# EAGLE design untitled5 (EAGLE 7.6.0)
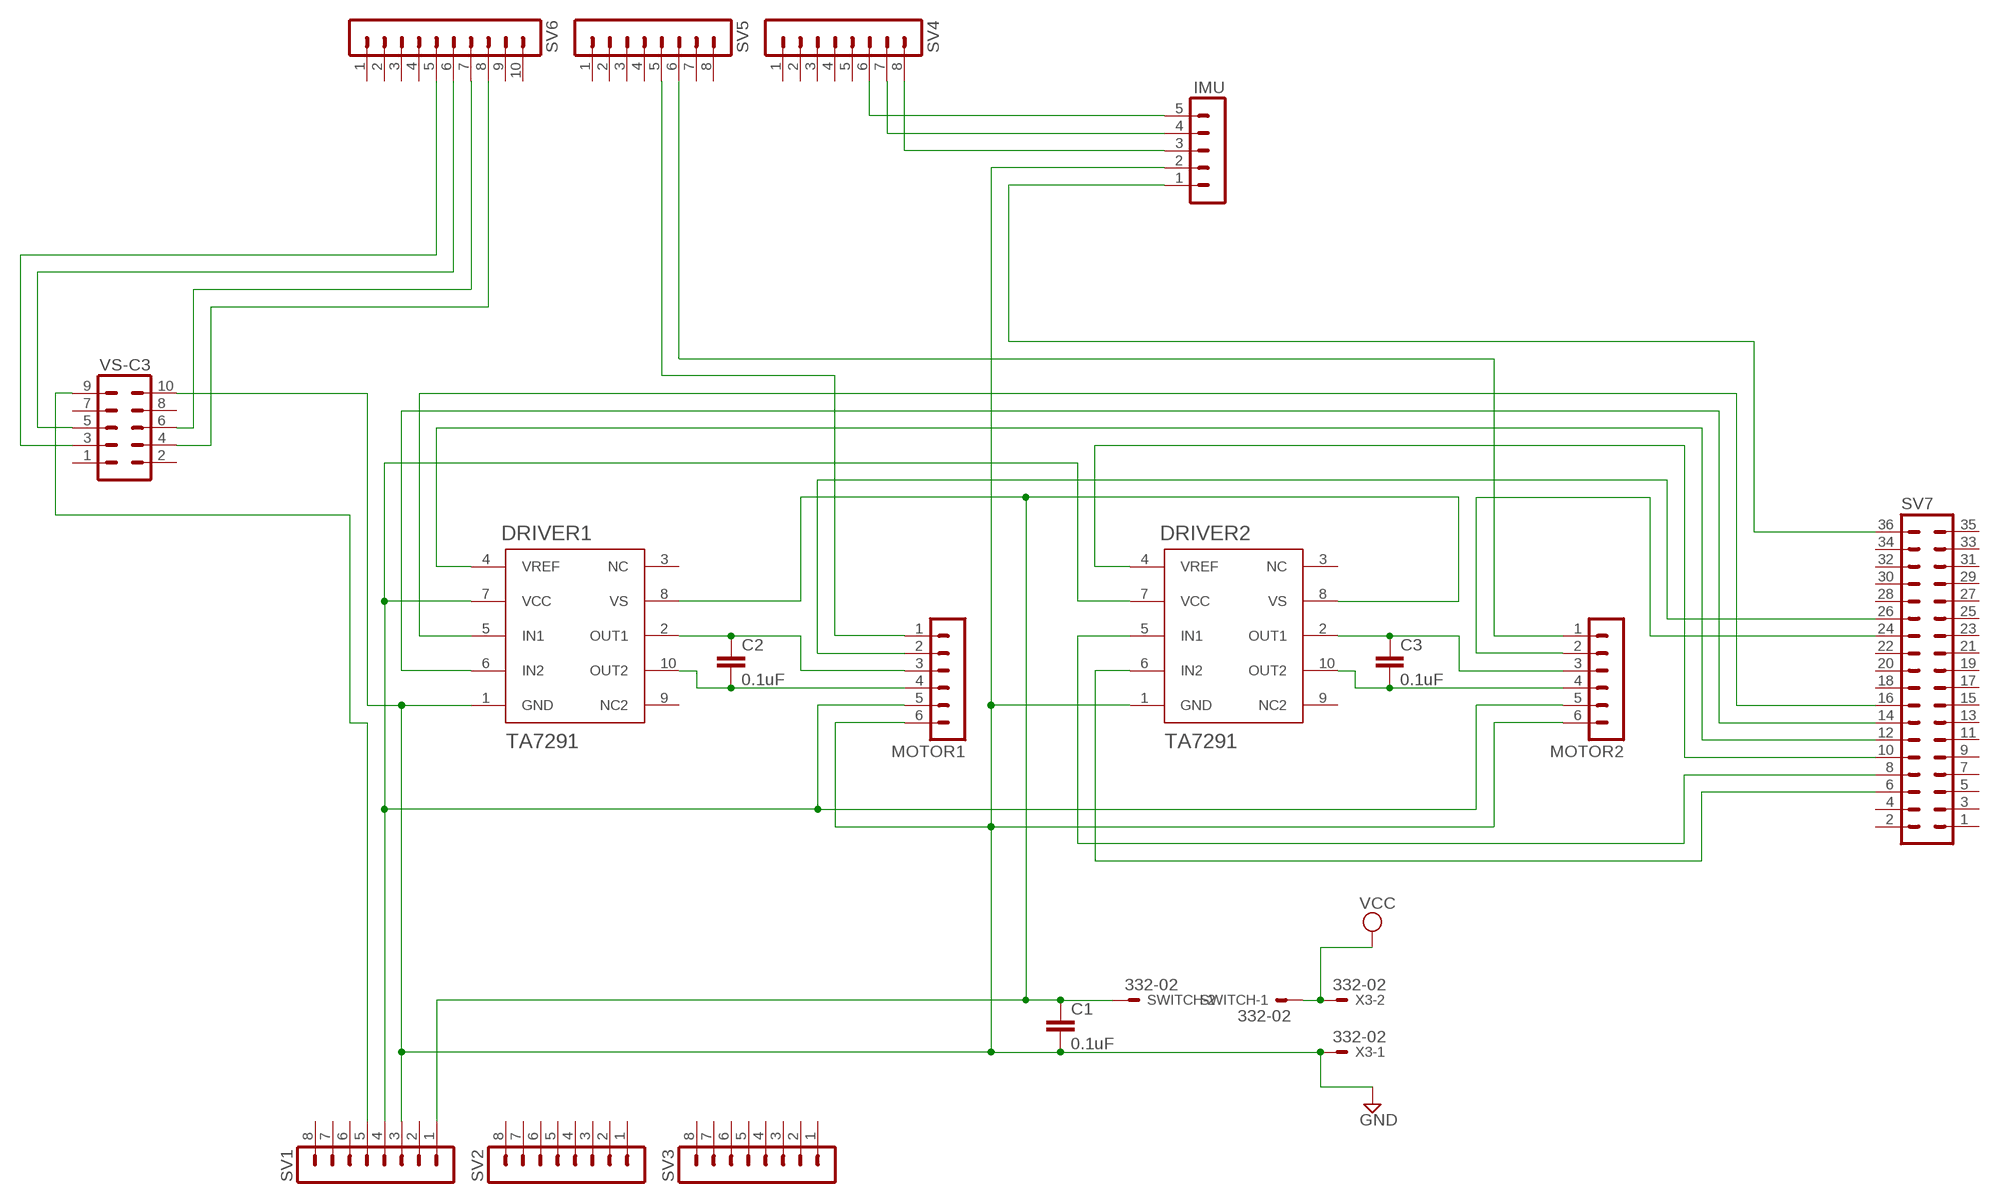
[diagram p0: schematic, sheet 1]

## Parts
C1  0.1uF  C5/2.5  [C5B2.5]
C2  0.1uF  C5/2.5  [C5B2.5]
C3  0.1uF  C5/2.5  [C5B2.5]
DRIVER1  TA7291  [HSIP10]
DRIVER2  TA7291  [HSIP10]
IMU  MA05-1  [MA05-1]
MOTOR1  MA06-1  [MA06-1]
MOTOR2  MA06-1  [MA06-1]
SV1  MA08-1  [MA08-1]
SV2  MA08-1  [MA08-1]
SV3  MA08-1  [MA08-1]
SV4  MA08-1  [MA08-1]
SV5  MA08-1  [MA08-1]
SV6  MA10-1  [MA10-1]
SV7  MA18-2  [MA18-2]
SWITCH  332-02  [332-02]
VS-C3  MA05-2  [MA05-2]
X3  332-02  [332-02]

## Nets
ENCODER: IMU.5 SV4.6
GND: C1.2 DRIVER1.1(GND) DRIVER2.1(GND) IMU.2 MOTOR1.6 MOTOR2.6 SV1.3 VS-C3.10 X3.1
N$1: C2.1 DRIVER1.2(OUT1) MOTOR1.3
N$2: C2.2 DRIVER1.10(OUT2) MOTOR1.4
N$3: C3.1 DRIVER2.2(OUT1) MOTOR2.3
N$4: C3.2 DRIVER2.10(OUT2) MOTOR2.4
N$5: IMU.1 SV7.36
N$6: MOTOR2.1 SV5.6
N$7: DRIVER1.7(VCC) DRIVER2.7(VCC) MOTOR1.5 MOTOR2.5 SV1.4
N$8: IMU.3 SV4.8
N$9: IMU.4 SV4.7
N$10: C1.1 DRIVER1.8(VS) DRIVER2.8(VS) SV1.1 SWITCH.2
N$11: DRIVER2.4(VREF) SV7.10
N$12: DRIVER1.5(IN1) SV7.16
N$13: MOTOR1.1 SV5.5
N$14: MOTOR1.2 SV7.26
N$15: MOTOR2.2 SV7.24
N$16: DRIVER1.6(IN2) SV7.14
N$17: DRIVER2.5(IN1) SV7.8
N$18: DRIVER2.6(IN2) SV7.6
N$19: SV1.5 VS-C3.9
N$20: SV6.6 VS-C3.5
N$21: SV6.5 VS-C3.3
N$22: SV6.8 VS-C3.4
N$23: SV6.7 VS-C3.6
N$24: DRIVER1.4(VREF) SV7.12
VCC: SWITCH.1 X3.2
Unconnected: DRIVER1.3(NC) DRIVER1.9(NC2) DRIVER2.3(NC) DRIVER2.9(NC2) SV1.2 SV1.6 SV1.7 SV1.8 SV2.1 SV2.2 SV2.3 SV2.4 SV2.5 SV2.6 SV2.7 SV2.8 SV3.1 SV3.2 SV3.3 SV3.4 SV3.5 SV3.6 SV3.7 SV3.8 SV4.1 SV4.2 SV4.3 SV4.4 SV4.5 SV5.1 SV5.2 SV5.3 SV5.4 SV5.7 SV5.8 SV6.1 SV6.2 SV6.3 SV6.4 SV6.9 SV6.10 SV7.1 SV7.2 SV7.3 SV7.4 SV7.5 SV7.7 SV7.9 SV7.11 SV7.13 SV7.15 SV7.17 SV7.18 SV7.19 SV7.20 SV7.21 SV7.22 SV7.23 SV7.25 SV7.27 SV7.28 SV7.29 SV7.30 SV7.31 SV7.32 SV7.33 SV7.34 SV7.35 VS-C3.1 VS-C3.2 VS-C3.7 VS-C3.8

## Library data of the parts
C1-C3 = capacitor-wima:C: CAPACITOR naming: grid - package width
DRIVER1 DRIVER2 = TA7291P:TA7291
IMU = con-lstb:MA05-1: PIN HEADER; OC_FARNELL: unknown; OC_NEWARK: unknown
MOTOR1 MOTOR2 = con-lstb:MA06-1: PIN HEADER; OC_FARNELL: unknown; OC_NEWARK: unknown
SV1-SV5 = con-lstb:MA08-1: PIN HEADER; OC_FARNELL: unknown; OC_NEWARK: unknown
SV6 = con-lstb:MA10-1: PIN HEADER; OC_FARNELL: unknown; OC_NEWARK: unknown
SV7 = con-lstb:MA18-2: PIN HEADER; OC_FARNELL: unknown; OC_NEWARK: unknown
SWITCH X3 = con-garry:332-02: 2 Pin - 2mm Dual Row Source: www.mpe-connector.de / garry_shortform_2012.pdf
VS-C3 = con-lstb:MA05-2: PIN HEADER; OC_FARNELL: unknown; OC_NEWARK: unknown

## Board
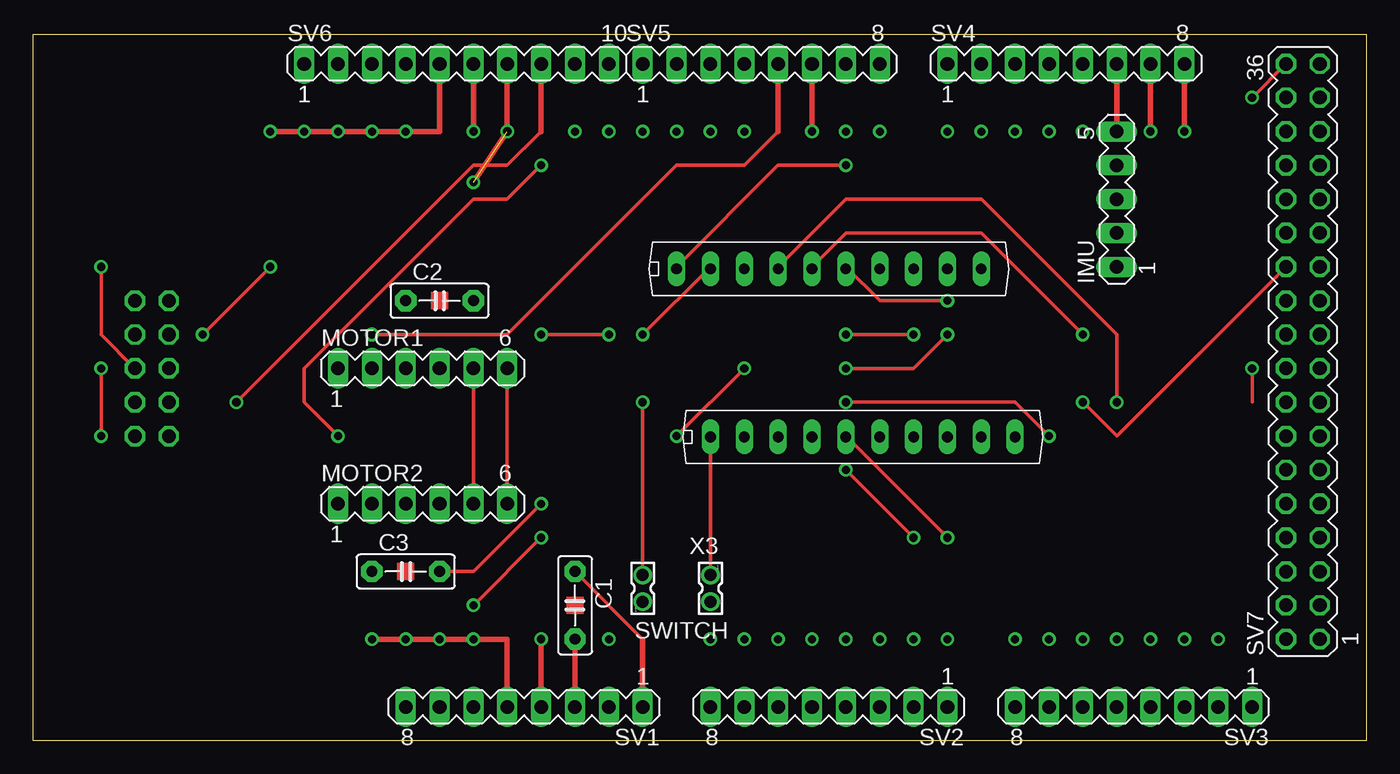
[diagram p1: board, top side]
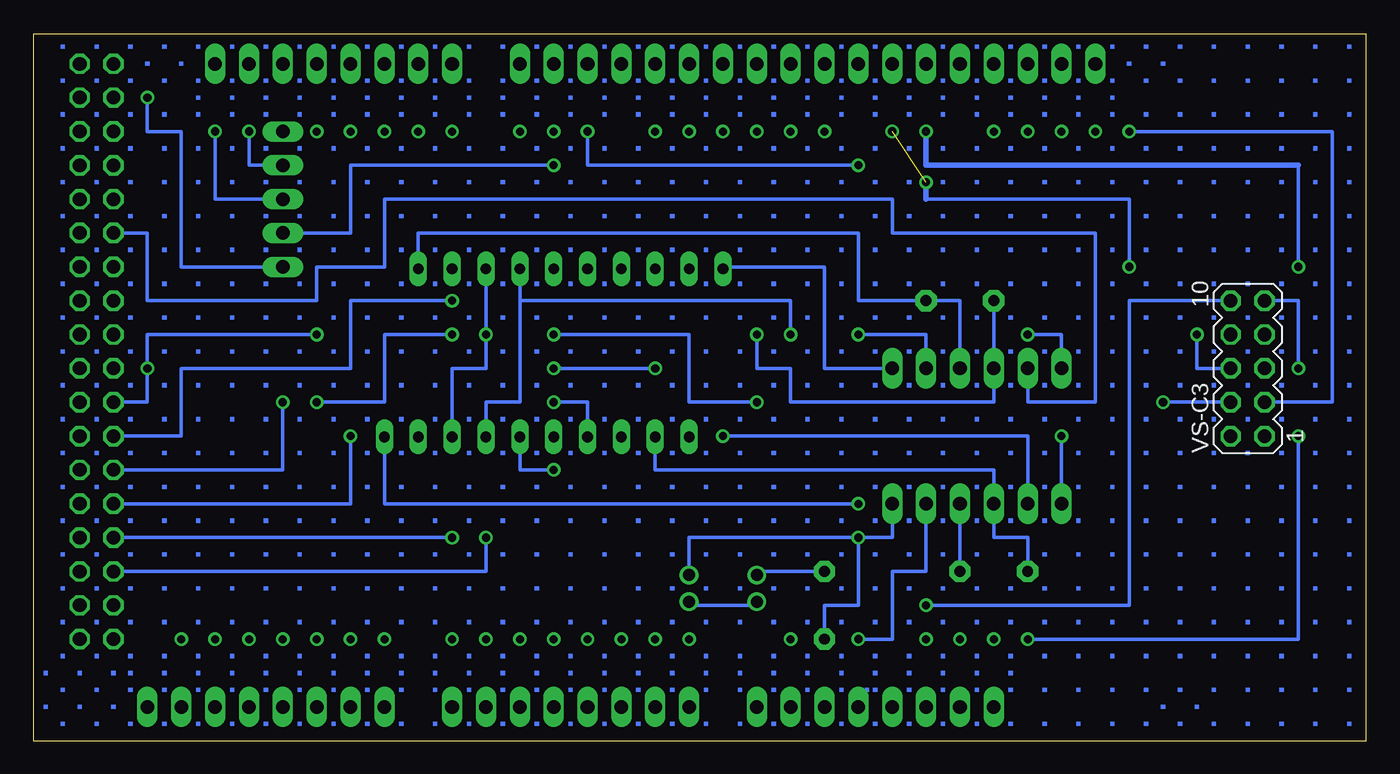
[diagram p2: board, bottom side, seen from below]

Size 100 x 53 mm. Coordinates in mm from the lower left corner, seen from the top.
Outline: 100,53 100,0 0,0 0,53 100,53
Copper layers (1*16): Top 0.035mm / dielectric 1.5mm / Bottom 0.035mm
Design rules "default": minimum track width 10mil, minimum drill 24mil, track to track 8mil, track to pad 8mil, pad to pad 8mil, via to via 8mil, smd to smd 8mil, copper to edge 40mil, drill to drill 8mil, minimum pad ring 10mil, minimum via ring 8mil, stop-mask expansion 4mil, vias tented up to drill 0mil, thermal gap 10mil

### Footprints (pad centres in the part's own frame; a part is rotated, then mirrored left to right if it is on the bottom)
C5B2.5 = drill 0.813 pad 1.6 octagon: 1 -2.54,0; 2 2.54,0
HSIP10 = drill 0.8 long: 1 -11.43,0; 2 -8.89,0; 3 -6.35,0; 4 -3.81,0; 5 -1.27,0; 6 1.27,0; 7 3.81,0; 8 6.35,0; 9 8.89,0; 10 11.43,0
MA05-1 = drill 1.016 long: 1 -5.08,0; 2 -2.54,0; 3 0,0; 4 2.54,0; 5 5.08,0
MA06-1 = drill 1.016 long: 1 -6.35,0; 2 -3.81,0; 3 -1.27,0; 4 1.27,0; 5 3.81,0; 6 6.35,0
MA08-1 = drill 1.016 long: 1 -8.89,0; 2 -6.35,0; 3 -3.81,0; 4 -1.27,0; 5 1.27,0; 6 3.81,0; 7 6.35,0; 8 8.89,0
MA10-1 = drill 1.016 long: 1 -11.43,0; 2 -8.89,0; 3 -6.35,0; 4 -3.81,0; 5 -1.27,0; 6 1.27,0; 7 3.81,0; 8 6.35,0; 9 8.89,0; 10 11.43,0
MA18-2 = drill 1.016 octagon: 1 -21.59,-1.27; 2 -21.59,1.27; 3 -19.05,-1.27; 4 -19.05,1.27; 5 -16.51,-1.27; 6 -16.51,1.27; 7 -13.97,-1.27; 8 -13.97,1.27; 9 -11.43,-1.27; 10 -11.43,1.27; 11 -8.89,-1.27; 12 -8.89,1.27; 13 -6.35,-1.27; 14 -6.35,1.27; 15 -3.81,-1.27; 16 -3.81,1.27; 17 -1.27,-1.27; 18 -1.27,1.27; 19 1.27,-1.27; 20 1.27,1.27; 21 3.81,-1.27; 22 3.81,1.27; 23 6.35,-1.27; 24 6.35,1.27; 25 8.89,-1.27; 26 8.89,1.27; 27 11.43,-1.27; 28 11.43,1.27; 29 13.97,-1.27; 30 13.97,1.27; 31 16.51,-1.27; 32 16.51,1.27; 33 19.05,-1.27; 34 19.05,1.27; 35 21.59,-1.27; 36 21.59,1.27
332-02 = drill 0.9 pad 1.27: 1 0,-1; 2 0,1
MA05-2 = drill 1.016 octagon: 1 -5.08,-1.27; 2 -5.08,1.27; 3 -2.54,-1.27; 4 -2.54,1.27; 5 0,-1.27; 6 0,1.27; 7 2.54,-1.27; 8 2.54,1.27; 9 5.08,-1.27; 10 5.08,1.27

### Placement (x,y rotation side)
C1  40.64,10.16 270 top
C2  30.48,33.02 0 top
C3  27.94,12.7 0 top
DRIVER1  59.69,35.4 0 top
DRIVER2  62.23,22.8 0 top
IMU  81.28,40.64 90 top
MOTOR1  29.21,27.94 0 top
MOTOR2  29.21,17.78 0 top
SV1  36.83,2.54 180 top
SV2  59.69,2.54 180 top
SV3  82.55,2.54 180 top
SV4  77.47,50.8 0 top
SV5  54.61,50.8 0 top
SV6  31.75,50.8 0 top
SV7  95.25,29.21 90 top
SWITCH  45.72,11.43 0 top
VS-C3  8.89,27.94 90 bottom
X3  50.8,11.43 180 top

### Tracks (layer width: path | path; a pad name or v marks a point on that pad's centre or on a via)
ENCODER
  Top 0.406: SV4.6 IMU.5
GND  (via drill 0.61)
  Top 0.254: v60.96,43.18 55.88,43.18 48.26,35.56 DRIVER1.1 | X3.1 DRIVER2.1 50.8,22.86 | v38.1,15.24 v33.02,10.16 | MOTOR2.6 MOTOR1.6
  Top 0.406: SV1.3 C1.2
  Bottom 0.254: MOTOR1.6 40.64,27.94 40.64,35.56 48.26,35.56 DRIVER1.1 | IMU.2 76.2,38.1 76.2,43.18 v60.96,43.18 | MOTOR2.6 35.56,15.24 v38.1,15.24 | v38.1,15.24 50.8,15.24 X3.1 | VS-C3.10 17.78,33.02 17.78,10.16 v33.02,10.16 | C1.2 40.64,10.16 38.1,10.16 v38.1,15.24
N$1  (via drill 0.61)
  Top 0.254: v45.72,30.48 50.8,35.56 DRIVER1.2
  Bottom 0.254: v45.72,30.48 45.72,27.94 43.18,27.94 43.18,25.4 27.94,25.4 MOTOR1.3 C2.1
N$2
  Bottom 0.254: DRIVER1.10 71.12,38.1 38.1,38.1 38.1,33.02 C2.2 30.48,33.02 MOTOR1.4
N$3
  Bottom 0.254: 53.34,22.86 DRIVER2.2 53.34,20.32 27.94,20.32 MOTOR2.3 27.94,15.24 25.4,15.24 C3.1
N$4  (via drill 0.61)
  Top 0.254: v38.1,17.78 33.02,12.7 C3.2
  Bottom 0.254: v38.1,17.78 73.66,17.78 DRIVER2.10 73.66,22.86 | C3.2 MOTOR2.4
N$5  (via drill 0.61)
  Top 0.254: SV7.36 v91.44,48.26
  Bottom 0.254: IMU.1 88.9,35.56 88.9,45.72 91.44,45.72 v91.44,48.26
N$6  (via drill 0.61)
  Top 0.254: v22.86,22.86 20.32,25.4 20.32,27.94 33.02,40.64 35.56,40.64 v38.1,43.18
  Top 0.406: SV5.6 v58.42,45.72
  Bottom 0.254: v22.86,22.86 MOTOR2.1 | v38.1,43.18 58.42,43.18 v58.42,45.72
N$7  (via drill 0.61)
  Top 0.254: v43.18,30.48 v38.1,30.48 | MOTOR1.5 MOTOR2.5
  Top 0.406: SV1.4 v38.1,7.62
  Bottom 0.254: MOTOR2.5 33.02,12.7 35.56,12.7 35.56,7.62 v38.1,7.62 | DRIVER2.7 66.04,25.4 63.5,25.4 63.5,33.02 | 63.5,33.02 DRIVER1.7 63.5,35.56 | MOTOR1.5 33.02,30.48 v38.1,30.48 | v43.18,30.48 43.18,33.02 63.5,33.02
N$8  (via drill 0.61)
  Top 0.406: SV4.8 v86.36,45.72
  Bottom 0.254: IMU.3 86.36,40.64 v86.36,45.72
N$9  (via drill 0.61)
  Top 0.406: SV4.7 v83.82,45.72
  Bottom 0.254: IMU.4 83.82,43.18 v83.82,45.72
N$10  (via drill 0.61)
  Top 0.254: C1.1 45.72,7.62 | v45.72,25.4 SWITCH.2 | v66.04,30.48 v60.96,30.48
  Top 0.406: SV1.1 45.72,7.62
  Bottom 0.254: C1.1 45.72,12.7 SWITCH.2 | DRIVER2.8 68.58,27.94 66.04,27.94 v66.04,30.48 DRIVER1.8 66.04,35.56 | v45.72,25.4 50.8,25.4 50.8,30.48 v60.96,30.48
N$11  (via drill 0.61)
  Top 0.254: v60.96,25.4 73.66,25.4 v76.2,22.86
  Bottom 0.254: DRIVER2.4 58.42,25.4 v60.96,25.4 | v76.2,22.86 76.2,17.78 SV7.10
N$12  (via drill 0.61)
  Top 0.254: v78.74,30.48 71.12,38.1 60.96,38.1 58.42,35.56 DRIVER1.5 | 91.44,25.4 v91.44,27.94
  Bottom 0.254: v78.74,30.48 91.44,30.48 v91.44,27.94 91.44,25.4 SV7.16
N$13  (via drill 0.61)
  Top 0.254: v25.4,30.48 35.56,30.48 48.26,43.18 53.34,43.18 55.88,45.72
  Top 0.406: SV5.5 55.88,45.72
  Bottom 0.254: MOTOR1.1 22.86,30.48 v25.4,30.48
N$14
  Bottom 0.254: MOTOR1.2 25.4,25.4 20.32,25.4 20.32,38.1 35.56,38.1 35.56,40.64 73.66,40.64 73.66,35.56 78.74,35.56 78.74,33.02 91.44,33.02 91.44,38.1 SV7.26
N$15  (via drill 0.61)
  Top 0.254: v53.34,27.94 v48.26,22.86 | v60.96,27.94 66.04,27.94 v68.58,30.48 | v78.74,25.4 81.28,22.86 SV7.24
  Bottom 0.254: MOTOR2.2 25.4,22.86 v48.26,22.86 | v60.96,27.94 v53.34,27.94 | v68.58,30.48 73.66,30.48 73.66,25.4 v78.74,25.4
N$16  (via drill 0.61)
  Top 0.254: v68.58,33.02 63.5,33.02 60.96,35.56 DRIVER1.6
  Bottom 0.254: v68.58,33.02 76.2,33.02 76.2,27.94 88.9,27.94 88.9,22.86 SV7.14
N$17  (via drill 0.61)
  Top 0.254: v68.58,15.24 60.96,22.86 DRIVER2.5
  Bottom 0.254: SV7.8 v68.58,15.24
N$18  (via drill 0.61)
  Top 0.254: v66.04,15.24 v60.96,20.32
  Bottom 0.254: v60.96,20.32 63.5,20.32 DRIVER2.6 63.5,22.86 | v66.04,15.24 66.04,12.7 SV7.6
N$19  (via drill 0.6, 0.61)
  Top 0.254: v5.08,22.86 v5.08,27.94
  Top 0.406: SV1.5 35.56,7.62 v25.4,7.62
  Bottom 0.254: VS-C3.9 5.08,33.02 v5.08,27.94 | v5.08,22.86 5.08,7.62 v25.4,7.62
N$20  (via drill 0.61)  (1 unrouted)
  Top 0.254: VS-C3.5 5.08,30.48 v5.08,35.56
  Top 0.406: SV6.6 v33.02,45.72
  Bottom 0.254: 5.08,43.18 v5.08,35.56
  Bottom 0.406: 5.08,43.18 33.02,43.18 v33.02,45.72
N$21  (via drill 0.6)
  Top 0.406: SV6.5 30.48,45.72 v17.78,45.72
  Bottom 0.254: VS-C3.3 2.54,25.4 2.54,45.72 v17.78,45.72
N$22  (via drill 0.61)
  Top 0.254: v15.24,25.4 33.02,43.18 35.56,43.18 38.1,45.72
  Top 0.406: SV6.8 38.1,45.72
  Bottom 0.254: v15.24,25.4 VS-C3.4
N$23  (via drill 0.61)  (2 unrouted)
  Top 0.254: v17.78,35.56 v12.7,30.48
  Top 0.406: SV6.7 v35.56,45.72 33.02,41.91
  Bottom 0.254: VS-C3.6 12.7,27.94 v12.7,30.48 | v17.78,35.56 17.78,40.64 33.02,40.64
  Bottom 0.406: 33.02,40.64 33.02,41.91
N$24  (via drill 0.61)
  Top 0.254: v81.28,25.4 81.28,30.48 71.12,40.64 60.96,40.64 55.88,35.56 DRIVER1.4
  Bottom 0.254: v81.28,25.4 81.28,20.32 SV7.12
N$25  (via drill 0.6)
  other vias: 50.8,45.72
N$26  (via drill 0.6)
  other vias: 22.86,45.72
N$27  (via drill 0.6)
  other vias: 25.4,45.72
N$28  (via drill 0.6)
  other vias: 27.94,45.72
N$29  (via drill 0.6)
  other vias: 20.32,45.72
N$30  (via drill 0.6)
  other vias: 33.02,41.91
N$33  (via drill 0.6)
  other vias: 40.64,45.72
N$34  (via drill 0.6)
  other vias: 43.18,45.72
N$35  (via drill 0.6)
  other vias: 45.72,45.72
N$36  (via drill 0.6)
  other vias: 48.26,45.72
N$38  (via drill 0.6)
  other vias: 53.34,45.72
N$41  (via drill 0.6)
  other vias: 60.96,45.72
N$42  (via drill 0.6)
  other vias: 63.5,45.72
N$43  (via drill 0.6)
  other vias: 68.58,45.72
N$44  (via drill 0.6)
  other vias: 71.12,45.72
N$45  (via drill 0.6)
  other vias: 73.66,45.72
N$46  (via drill 0.6)
  other vias: 76.2,45.72
N$47  (via drill 0.6)
  other vias: 78.74,45.72
N$51  (via drill 0.6)
  other vias: 88.9,7.62
N$52  (via drill 0.6)
  other vias: 86.36,7.62
N$53  (via drill 0.6)
  other vias: 83.82,7.62
N$54  (via drill 0.6)
  other vias: 81.28,7.62
N$55  (via drill 0.6)
  other vias: 78.74,7.62
N$56  (via drill 0.6)
  other vias: 76.2,7.62
N$57  (via drill 0.6)
  other vias: 73.66,7.62
N$58  (via drill 0.6)
  other vias: 68.58,7.62
N$59  (via drill 0.6)
  other vias: 66.04,7.62
N$60  (via drill 0.6)
  other vias: 63.5,7.62
N$61  (via drill 0.6)
  other vias: 60.96,7.62
N$62  (via drill 0.6)
  other vias: 58.42,7.62
N$63  (via drill 0.6)
  other vias: 55.88,7.62
N$64  (via drill 0.6)
  other vias: 53.34,7.62
N$65  (via drill 0.6)
  other vias: 50.8,7.62
N$67  (via drill 0.6)
  other vias: 43.18,7.62
N$71  (via drill 0.6)
  other vias: 33.02,7.62
N$72  (via drill 0.6)
  other vias: 30.48,7.62
N$73  (via drill 0.6)
  other vias: 27.94,7.62
VCC
  Bottom 0.254: SWITCH.1 45.72,10.16 50.8,10.16 X3.2
(copper drawn outside any net)
  shapes: Bottom area x921, Top area x3